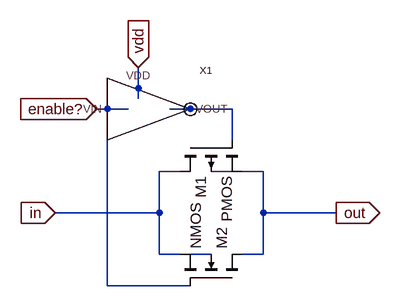
[diagram p0: schematic transmissionGate.asc]
transmissionGate.asc, the LTspice schematic file:
Version 4
SHEET 1 880 680
WIRE 112 32 112 -16
WIRE 64 48 48 48
WIRE 96 48 64 48
WIRE 256 48 160 48
WIRE 256 96 256 48
WIRE 176 144 144 144
WIRE 256 144 224 144
WIRE 304 144 272 144
WIRE 144 208 144 144
WIRE 144 208 -16 208
WIRE 304 208 304 144
WIRE 416 208 304 208
WIRE 144 272 144 208
WIRE 176 272 144 272
WIRE 224 272 192 272
WIRE 304 272 304 208
WIRE 304 272 272 272
WIRE 64 320 64 48
WIRE 192 320 64 320
FLAG -16 208 in
IOPIN -16 208 In
FLAG 416 208 out
IOPIN 416 208 Out
FLAG 48 48 enable?
IOPIN 48 48 In
FLAG 112 -16 vdd
IOPIN 112 -16 In
SYMBOL inverter 112 48 R0
SYMATTR InstName X1
SYMBOL pmos4 176 96 M90
SYMATTR InstName M1
SYMATTR Value2 l=90n w=400n
SYMBOL nmos4 272 320 M270
SYMATTR InstName M2
SYMATTR Value2 l=90n w=200n

The netlist it stands for:
* transmissionGate.asc
XX1 vdd N001 enable? inverter  ; pins VDD VOUT VIN
M1 in N001 out N002 PMOS l=90n w=400n
M2 out enable? in N003 NMOS l=90n w=200n
.model NMOS NMOS
.model PMOS PMOS
.lib standard.mos
.backanno
.end